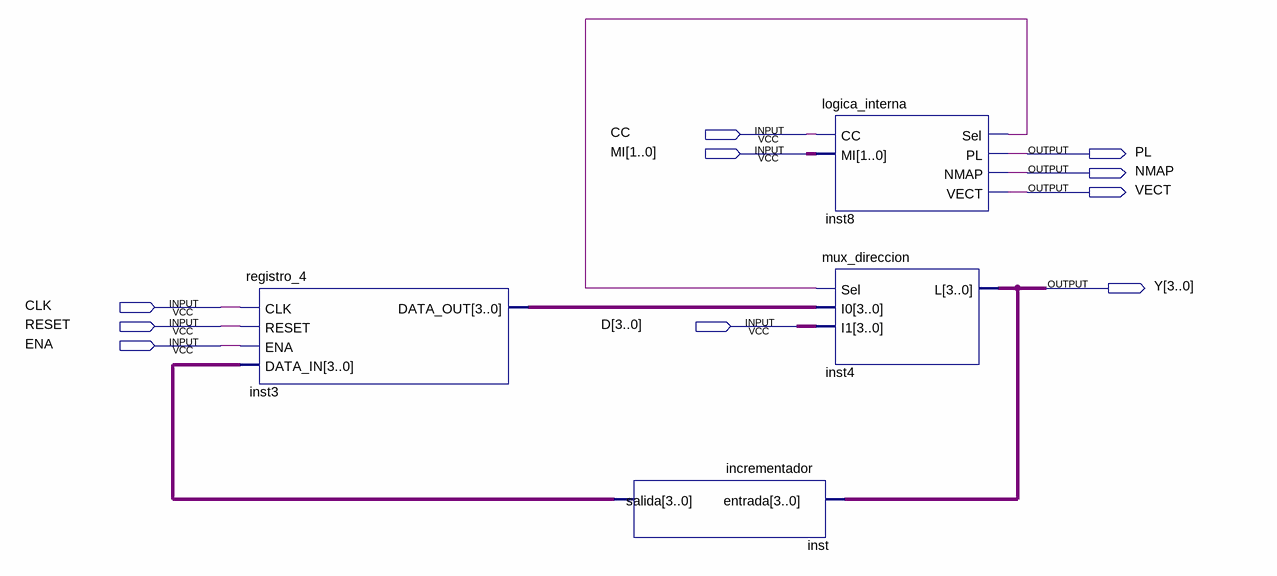
[diagram p0: schematic sheet]
// Quartus schematic secuenciador.bdf as structural Verilog: 4 symbols, 10 pins
module secuenciador (
  input  CC,
  input  [1:0] MI,
  input  CLK,
  input  RESET,
  input  [3:0] D,
  input  ENA,
  output PL,
  output NMAP,
  output VECT,
  output [3:0] Y
);

  wire inst8_sel;
  wire [3:0] inst3_data_out, inst_salida;

  registro_4 inst3 (.CLK(CLK), .RESET(RESET), .ENA(ENA), .DATA_IN(inst_salida), .DATA_OUT(inst3_data_out));
  incrementador inst (.entrada(Y), .salida(inst_salida));
  logica_interna inst8 (.CC(CC), .MI(MI), .Sel(inst8_sel), .PL(PL), .NMAP(NMAP), .VECT(VECT));
  mux_direccion inst4 (.Sel(inst8_sel), .I0(inst3_data_out), .I1(D), .L(Y));
endmodule
